# EAGLE schematic w13_ (EAGLE 8.0.1)
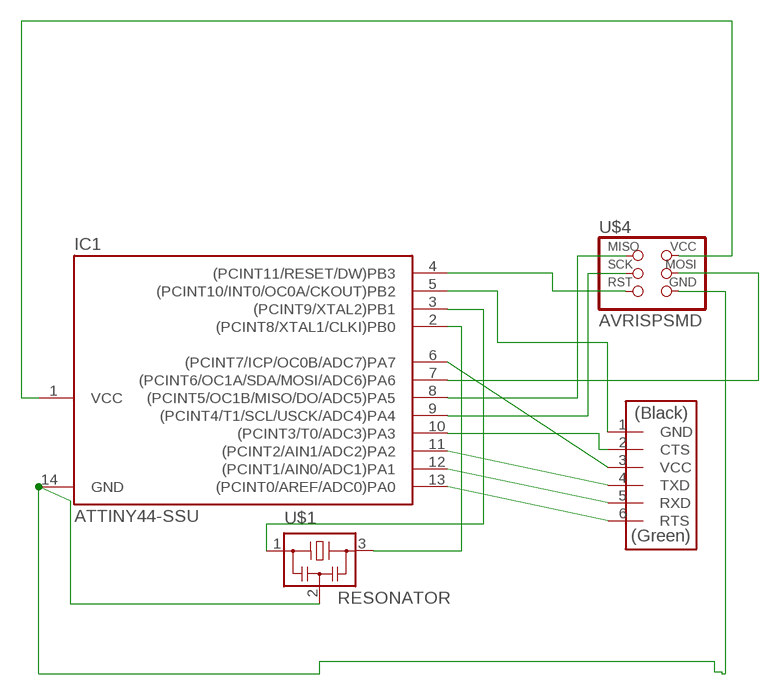
[diagram p0: schematic, sheet 1]

## Parts
IC1  ATTINY44-SSU  [SOIC14]
U$1  RESONATOR  [EFOBM]
U$3  FTDI-SMD-HEADER  [1X06SMD]
U$4  AVRISPSMD  [2X03SMD]

## Nets
N$1: IC1.2((PCINT8/XTAL1/CLKI)PB0) U$1.3
N$2: IC1.3((PCINT9/XTAL2)PB1) U$1.1
N$3: IC1.4((PCINT11/RESET/DW)PB3) U$4.5(RST)
N$4: IC1.7((PCINT6/OC1A/SDA/MOSI/ADC6)PA6) U$4.4(MOSI)
N$5: IC1.8((PCINT5/OC1B/MISO/DO/ADC5)PA5) U$4.1(MISO)
N$6: IC1.9((PCINT4/T1/SCL/USCK/ADC4)PA4) U$4.3(SCK)
N$7: IC1.5((PCINT10/INT0/OC0A/CKOUT)PB2) U$3.1(GND)
N$8: IC1.1(VCC) U$4.2(VCC)
N$9: IC1.13((PCINT0/AREF/ADC0)PA0) U$3.6(RTS)
N$10: IC1.12((PCINT1/AIN0/ADC1)PA1) U$3.5(RXD)
N$11: IC1.11((PCINT2/AIN1/ADC2)PA2) U$3.4(TXD)
N$12: IC1.10((PCINT3/T0/ADC3)PA3) U$3.2(CTS)
N$13: IC1.6((PCINT7/ICP/OC0B/ADC7)PA7) U$3.3(VCC)
N$15: IC1.14(GND) U$1.2 U$4.6(GND)

## Library data of the parts
IC1 = fab:ATTINY44
U$1 = fab:RESONATOR
U$3 = fab:FTDI-SMD-HEADER
U$4 = fab:AVRISP